# Altium schematic sheet Non-relay fused CKTS.SchDoc
size A
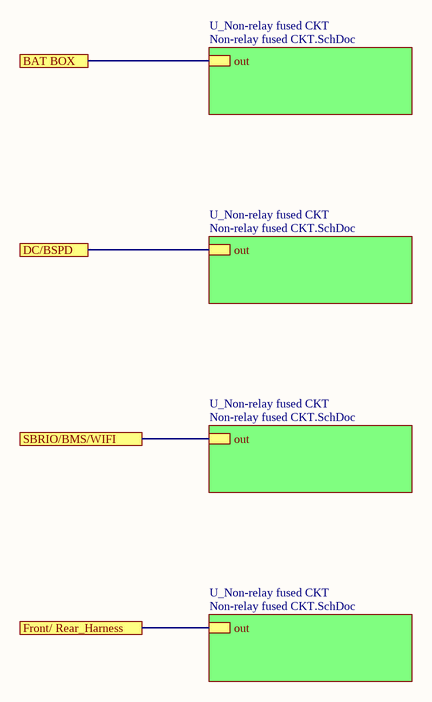
[diagram p0: Non-relay fused CKTS.SchDoc]

## Sub-sheets
U_Non-relay fused CKT = Non-relay fused CKT.SchDoc: out
U_Non-relay fused CKT = Non-relay fused CKT.SchDoc: out
U_Non-relay fused CKT = Non-relay fused CKT.SchDoc: out
U_Non-relay fused CKT = Non-relay fused CKT.SchDoc: out

## Ports
BAT BOX, DC/BSPD, Front/ Rear_Harness, SBRIO/BMS/WIFI

## Nets
BAT BOX: port BAT BOX, sheet U_Non-relay fused CKT/out
DC/BSPD: port DC/BSPD, sheet U_Non-relay fused CKT/out
Front/ Rear_Harness: port Front/ Rear_Harness, sheet U_Non-relay fused CKT/out
SBRIO/BMS/WIFI: port SBRIO/BMS/WIFI, sheet U_Non-relay fused CKT/out